# Altium schematic sheet AUTOMATIC_WATER_PUMPS_V1.SchDoc
size A3; SheetNumber: 1; SheetTotal: 1
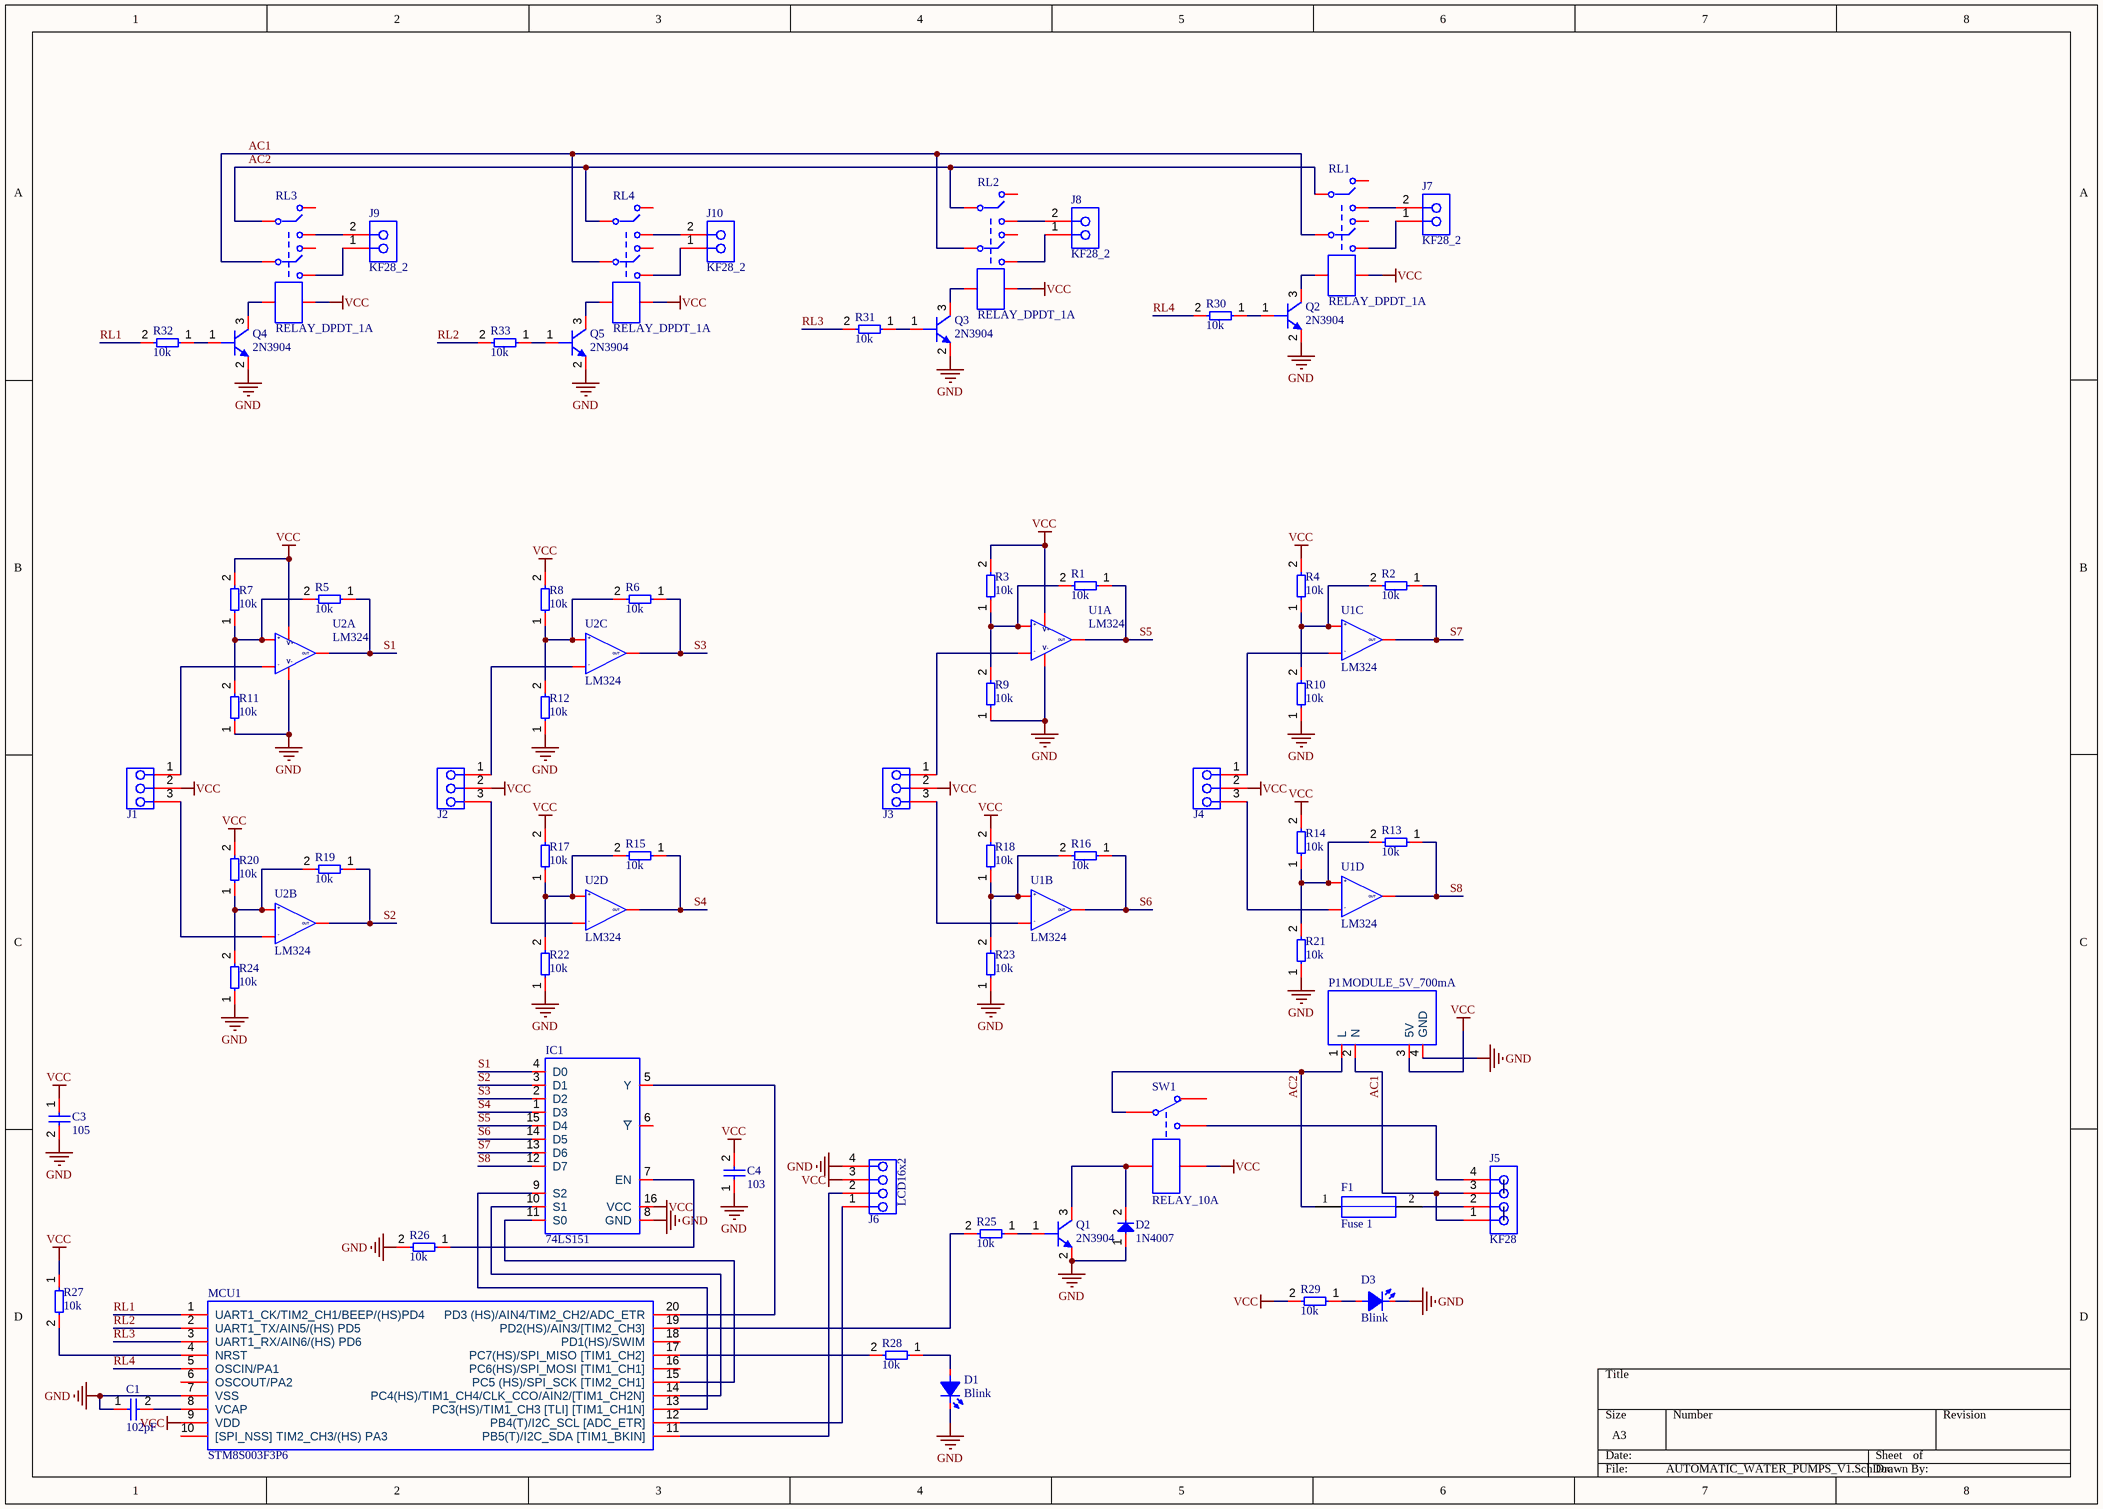
[diagram p0: AUTOMATIC_WATER_PUMPS_V1.SchDoc]

## Parts
C1  102pF  [C0805]
C3  105  [C0805]
C4  103  [C0805]
D1  Blink  [L0805RED]
D2  1N4007  [DO-214AC(SMA)]
D3  Blink  [L0805RED]
F1  Fuse 1  [FUSE2]
IC1  74LS151  [SOP16]
J1  WT1  [JST - XH - Thru (R) - 3Pin - 2.54mm]  (value not drawn)
J2  WT2  [JST - XH - Thru (R) - 3Pin - 2.54mm]  (value not drawn)
J3  WT3  [JST - XH - Thru (R) - 3Pin - 2.54mm]  (value not drawn)
J4  WT4  [JST - XH - Thru (R) - 3Pin - 2.54mm]  (value not drawn)
J5  KF28  [HEADER_KF128_4_5.08MM]
J6  LCD16x2  [JST - XH - Thru (R) - 4Pin - 2.54mm]
J7  KF28_2  [HEADER_KF128_2_5.08MM]
J8  KF28_2  [HEADER_KF128_2_5.08MM]
J9  KF28_2  [HEADER_KF128_2_5.08MM]
J10  KF28_2  [HEADER_KF128_2_5.08MM]
MCU1  STM8S003F3P6  [TSSOP20_0.65_4.4]
P1  MODULE_5V_700mA  [MODULE_5V_700mA]
Q1  2N3904  [SOT23-3]
Q2  2N3904  [SOT23-3]
Q3  2N3904  [SOT23-3]
Q4  2N3904  [SOT23-3]
Q5  2N3904  [SOT23-3]
R1  10k  [R0805]
R2  10k  [R0805]
R3  10k  [R0805]
R4  10k  [R0805]
R5  10k  [R0805]
R6  10k  [R0805]
R7  10k  [R0805]
R8  10k  [R0805]
R9  10k  [R0805]
R10  10k  [R0805]
R11  10k  [R0805]
R12  10k  [R0805]
R13  10k  [R0805]
R14  10k  [R0805]
R15  10k  [R0805]
R16  10k  [R0805]
R17  10k  [R0805]
R18  10k  [R0805]
R19  10k  [R0805]
R20  10k  [R0805]
R21  10k  [R0805]
R22  10k  [R0805]
R23  10k  [R0805]
R24  10k  [R0805]
R25  10k  [R0805]
R26  10k  [R0805]
R27  10k  [R0805]
R28  10k  [R0805]
R29  10k  [R0805]
R30  10k  [R0805]
R31  10k  [R0805]
R32  10k  [R0805]
R33  10k  [R0805]
RL1  RELAY_DPDT_1A  [RELAY_DPDT_1A]
RL2  RELAY_DPDT_1A  [RELAY_DPDT_1A]
RL3  RELAY_DPDT_1A  [RELAY_DPDT_1A]
RL4  RELAY_DPDT_1A  [RELAY_DPDT_1A]
SW1  RELAY_10A  [RELAY_10A_5PIN]
U1  LM324  [SOP-14]  (parts A,B,C,D of 4)
U2  LM324  [SOP-14]  (parts A,B,C,D of 4)

## Nets
GND: C1.1 C3.2 C4.1 D1.2(K) D2.1 D3.2(K) IC1.8(GND) J6.4 MCU1.7(VSS) P1.4(GND) Q1.2(E) Q2.2(E) Q3.2(E) Q4.2(E) Q5.2(E) R9.1 R10.1 R11.1 R12.1 R21.1 R22.1 R23.1 R24.1 R26.2 U1.11 U2.11
VCC: C3.1 C4.2 IC1.16(VCC) J1.2 J2.2 J3.2 J4.2 J6.3 MCU1.9(VDD) P1.3(5V) R3.2 R4.2 R7.2 R8.2 R14.2 R17.2 R18.2 R20.2 R27.1 R29.2 RL1.8 RL2.8 RL3.8 RL4.8 SW1.3 U1.4 U2.4
AC1: J5.1 J5.3 P1.2(N) RL1.5 RL2.5 RL3.5 RL4.5
AC2: F1.1 P1.1(L) RL1.2 RL2.2 RL3.2 RL4.2 SW1.2
RL1: MCU1.1(UART1_CK/TIM2_CH1/BEEP/(HS)PD4) R32.2
RL2: MCU1.2(UART1_TX/AIN5/(HS)_PD5) R33.2
RL3: MCU1.3(UART1_RX/AIN6/(HS)_PD6) R31.2
RL4: MCU1.5(OSCIN/PA1) R30.2
S1: IC1.4(D0) R5.1 U2.1(OUT)
S2: IC1.3(D1) R19.1 U2.7(OUT)
S3: IC1.2(D2) R6.1 U2.8(OUT)
S4: IC1.1(D3) R15.1 U2.14(OUT)
S5: IC1.15(D4) R1.1 U1.1(OUT)
S6: IC1.14(D5) R16.1 U1.7(OUT)
S7: IC1.13(D6) R2.1 U1.8(OUT)
S8: IC1.12(D7) R13.1 U1.14(OUT)
NetC1_2: C1.2 MCU1.8(VCAP)
NetD1_1: D1.1(A) R28.1
NetD2_2: D2.2 Q1.3(C) SW1.1
NetD3_1: D3.1(A) R29.1
NetF1_2: F1.2 J5.2
NetIC1_5: IC1.5(Y) MCU1.20(PD3_(HS)/AIN4/TIM2_CH2/ADC_ETR)
NetIC1_7: IC1.7(EN) R26.1
NetIC1_9: IC1.9(S2) MCU1.13(PC3(HS)/TIM1_CH3_[TLI]_[TIM1_CH1N])
NetIC1_10: IC1.10(S1) MCU1.14(PC4(HS)/TIM1_CH4/CLK_CCO/AIN2/[TIM1_CH2N])
NetIC1_11: IC1.11(S0) MCU1.15(PC5_(HS)/SPI_SCK_[TIM2_CH1])
NetJ1_1: J1.1 U2.2(-)
NetJ1_3: J1.3 U2.6(-)
NetJ2_1: J2.1 U2.9(-)
NetJ2_3: J2.3 U2.13(-)
NetJ3_1: J3.1 U1.2(-)
NetJ3_3: J3.3 U1.6(-)
NetJ4_1: J4.1 U1.9(-)
NetJ4_3: J4.3 U1.13(-)
NetJ5_4: J5.4 SW1.5
NetJ6_1: J6.1 MCU1.12(PB4(T)/I2C_SCL_[ADC_ETR])
NetJ6_2: J6.2 MCU1.11(PB5(T)/I2C_SDA_[TIM1_BKIN])
NetJ7_1: J7.1 RL1.6
NetJ7_2: J7.2 RL1.3
NetJ8_1: J8.1 RL2.6
NetJ8_2: J8.2 RL2.3
NetJ9_1: J9.1 RL3.6
NetJ9_2: J9.2 RL3.3
NetJ10_1: J10.1 RL4.6
NetJ10_2: J10.2 RL4.3
NetMCU1_4: MCU1.4(NRST) R27.2
NetMCU1_17: MCU1.17(PC7(HS)/SPI_MISO_[TIM1_CH2]) R28.2
NetMCU1_19: MCU1.19(PD2(HS)/AIN3/[TIM2_CH3]) R25.2
NetQ1_1: Q1.1(B) R25.1
NetQ2_1: Q2.1(B) R30.1
NetQ2_3: Q2.3(C) RL1.7
NetQ3_1: Q3.1(B) R31.1
NetQ3_3: Q3.3(C) RL2.7
NetQ4_1: Q4.1(B) R32.1
NetQ4_3: Q4.3(C) RL3.7
NetQ5_1: Q5.1(B) R33.1
NetQ5_3: Q5.3(C) RL4.7
NetR1_2: R1.2 R3.1 R9.2 U1.3(+)
NetR2_2: R2.2 R4.1 R10.2 U1.10(+)
NetR5_2: R5.2 R7.1 R11.2 U2.3(+)
NetR6_2: R6.2 R8.1 R12.2 U2.10(+)
NetR13_2: R13.2 R14.1 R21.2 U1.12(+)
NetR15_2: R15.2 R17.1 R22.2 U2.12(+)
NetR16_2: R16.2 R18.1 R23.2 U1.5
NetR19_2: R19.2 R20.1 R24.2 U2.5

Not connected (* = marked no-connect by the designer): IC1 6(~{Y}); MCU1 6(OSCOUT/PA2) 10([SPI_NSS]_TIM2_CH3/(HS)_PA3) 16(PC6(HS)/SPI_MOSI_[TIM1_CH1]) 18(PD1(HS)/SWIM); RL1 1 4; RL2 1 4; RL3 1 4; RL4 1 4; SW1 4

## Notes on the sheet
- (in symbol LM324, part A) V+; V-

## Library data of the parts
C1 = Capacitors(SMD)
C3 C4 = C0805
D1 D3 = LED0805
D2 = Diode 1N4007-DO214AC(SMA)
IC1 = 74LS151: 8-input multiplexer
J1-J4 = JST - XH - Thru (R) - 3Pin - 2.54mm
J5 = HEADER_KF128_4_5.08MM
J6 = JST - XH - Thru (R) - 4Pin - 2.54mm
J7-J10 = HEADER_KF128_2_5.08MM
Q1-Q5 = 2N3904 (SOT-23)
R1-R33 = Resistor SMD
U1 U2 = LM324: Quad-Operational Amp
F1 = Fuse 1: Published: 8-Jun-2000; LatestRevisionDate: 17-Jul-2002; LatestRevisionNote: Re-released for DXP Platform.; PackageReference: PIN-W2/E2.8; Publisher: Altium Limited; PackageDescription: Thru-Hole; 2 Leads